# Altium schematic sheet Microcontroller.SchDoc
size A4; SheetNumber: 2; SheetTotal: 4
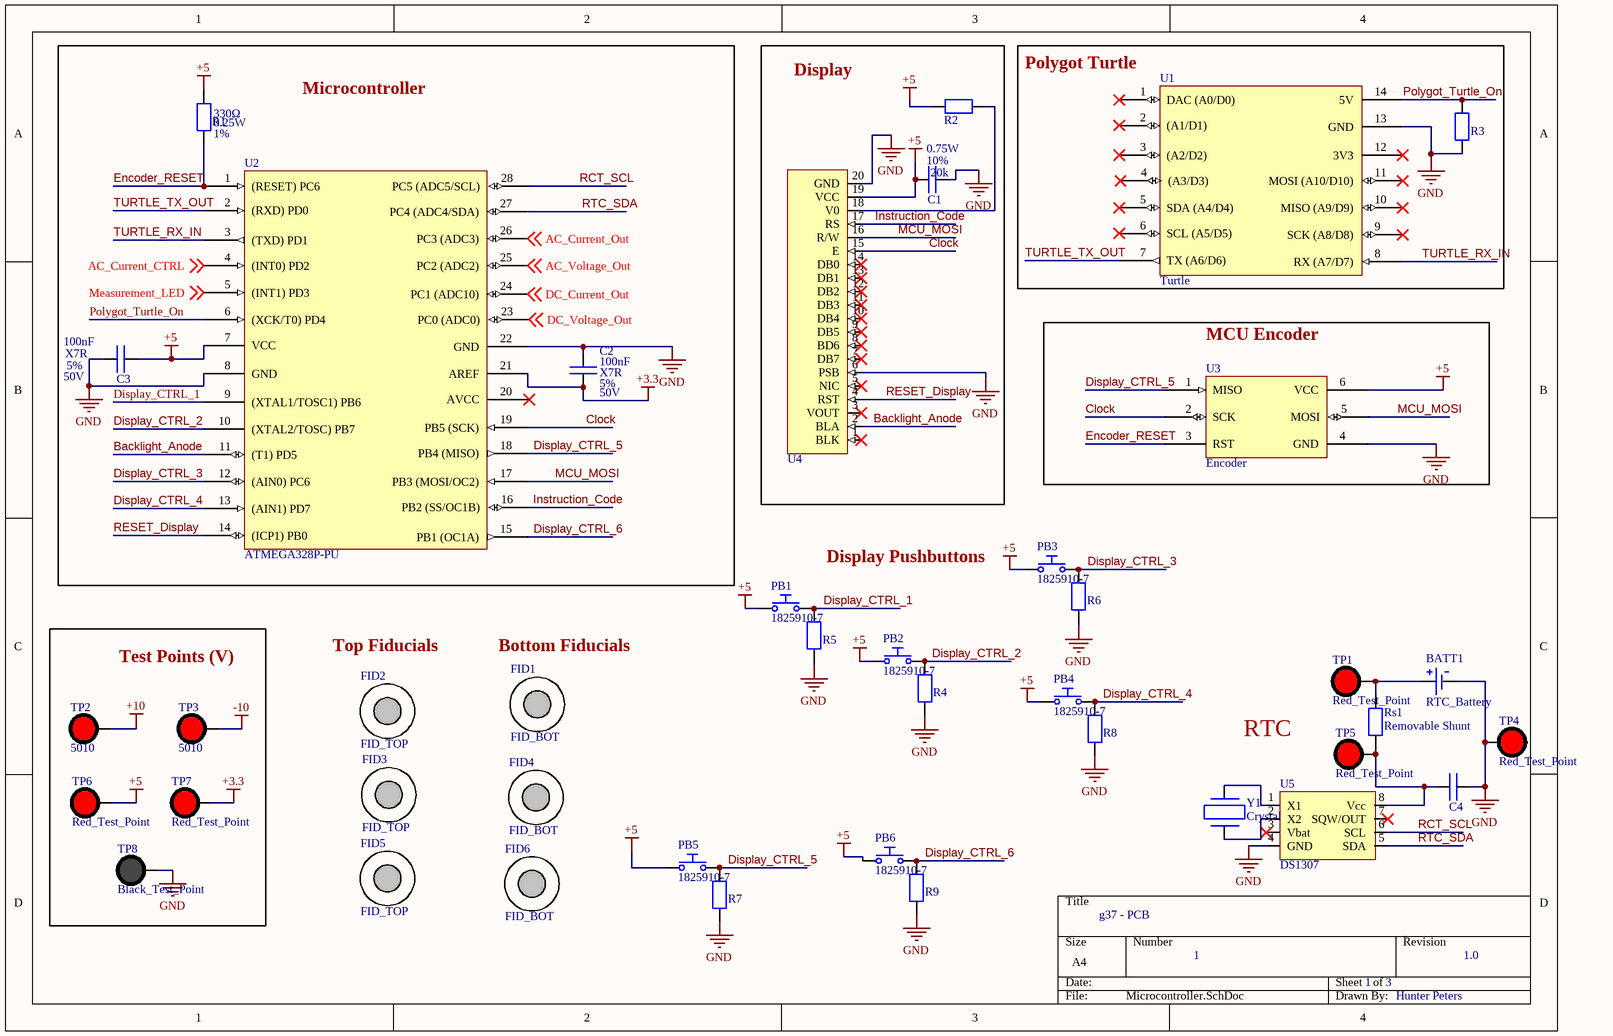
[diagram p0: Microcontroller.SchDoc]

## Parts
BATT1  RTC_Battery  [Battery Holder]
C1  Capacitor  [Capacitor]  (value not drawn)
C2  Capacitor  [Capacitor]  (value not drawn)
C3  Capacitor  [Capacitor]  (value not drawn)
C4  Capacitor  [Capacitor]  (value not drawn)
FID1  FID_BOT  [Fiducial_TOP]
FID2  FID_TOP  [Fiducial_TOP]
FID3  FID_TOP  [Fiducial_TOP]
FID4  FID_BOT  [Fiducial_TOP]
FID5  FID_TOP  [Fiducial_TOP]
FID6  FID_BOT  [Fiducial_TOP]
PB1  1825910-7  [Pushbutton]
PB2  1825910-7  [Pushbutton]
PB3  1825910-7  [Pushbutton]
PB4  1825910-7  [Pushbutton]
PB5  1825910-7  [Pushbutton]
PB6  1825910-7  [Pushbutton]
R1  Resistor  [Resistor]  (value not drawn)
R2  Resistor  [Resistor]  (value not drawn)
R3  Resistor  [Resistor]  (value not drawn)
R4  Resistor  [Resistor]  (value not drawn)
R5  Resistor  [Resistor]  (value not drawn)
R6  Resistor  [Resistor]  (value not drawn)
R7  Resistor  [Resistor]  (value not drawn)
R8  Resistor  [Resistor]  (value not drawn)
R9  Resistor  [Resistor]  (value not drawn)
Rs1  Removable Shunt  [Current_Shunt]
TP1  Red_Test_Point  [TP]
TP2  5010  [TP]
TP3  5010  [TP]
TP4  Red_Test_Point  [TP]
TP5  Red_Test_Point  [TP]
TP6  Red_Test_Point  [TP]
TP7  Red_Test_Point  [TP]
TP8  Black_Test_Point  [TP]
U1  Turtle  [Polygot-Turtle]
U2  ATMEGA328P-PU  [ATMEGA832P\]
U3  Encoder  [Encoder_No_Breakout]
U4  LED Display  [LED Display]  (value not drawn)
U5  DS1307  [Op Amp]
Y1  Crystal  [Crystal]

## Blocks framed on the sheet
Microcontroller: C2 C3 R1 U2
Display: C1 R2 U4
Polygot Turtle: R3 U1
MCU Encoder: U3
Test Points (V): TP2 TP3 TP6-TP8

## Nets
+3.3: C2.1 TP7.1 U2.21(AREF)
+5: C1.1 C3.1 PB1.1 PB2.1 PB3.1 PB4.1 PB5.1 PB6.1 R1.1 R2.1 TP6.1 U2.7(VCC) U3.6(VCC) U4.19(VCC)
+10: TP2.1
-10: TP3.1
GND: BATT1.2 C1.2 C2.2 C3.2 C4.2 R3.1 R4.1 R5.1 R6.1 R7.1 R8.1 R9.1 TP4.1 TP8.1 U1.13(GND) U2.8(GND) U2.22(GND) U3.4(GND) U4.6(PSB) U4.20(GND) U5.4(GND)
AC_Current_CTRL: U2.4((INT0)_PD2) ; off-sheet AC_Current_CTRL
AC_Current_Out: U2.26(PC3_(ADC3)) ; off-sheet AC_Current_Out
AC_Voltage_Out: U2.25(PC2_(ADC2)) ; off-sheet AC_Voltage_Out
Backlight_Anode: U2.11((T1)_PD5) U4.2(BLA)
Clock: U2.19(PB5_(SCK)) U3.2(SCK) U4.15(E)
DC_Current_Out: U2.24(PC1_(ADC10)) ; off-sheet DC_Current_Out
DC_Voltage_Out: U2.23(PC0_(ADC0)) ; off-sheet DC_Voltage_Out
Display_CTRL_1: PB1.2 R5.2 U2.9((XTAL1/TOSC1)_PB6)
Display_CTRL_2: PB2.2 R4.2 U2.10((XTAL2/TOSC)_PB7)
Display_CTRL_3: PB3.2 R6.2 U2.12((AIN0)_PC6)
Display_CTRL_4: PB4.2 R8.2 U2.13((AIN1)_PD7)
Display_CTRL_5: PB5.2 R7.2 U2.18(PB4_(MISO)) U3.1(MISO)
Display_CTRL_6: PB6.2 R9.2 U2.15(PB1_(OC1A))
Encoder_RESET: R1.2 U2.1((RESET)_PC6) U3.3(RST)
Instruction_Code: U2.16(PB2_(SS/OC1B)) U4.17(RS)
MCU_MOSI: U2.17(PB3_(MOSI/OC2)) U3.5(MOSI) U4.16(R/W)
Measurement_LED: U2.5((INT1)_PD3) ; off-sheet Measurement_LED
Polygot_Turtle_On: R3.2 U1.14(5V) U2.6((XCK/T0)_PD4)
RCT_SCL: U2.28(PC5_(ADC5/SCL)) U5.6(SCL)
RESET_Display: U2.14((ICP1)_PB0) U4.4(RST)
RTC_SDA: U2.27(PC4_(ADC4/SDA)) U5.5(SDA)
TURTLE_RX_IN: U1.8(RX_(A7/D7)) U2.3((TXD)_PD1)
TURTLE_TX_OUT: U1.7(TX_(A6/D6)) U2.2((RXD)_PD0)
NetBATT1_1: BATT1.1 Rs1.2 TP1.1
NetC4_1: C4.1 Rs1.1 TP5.1 U5.8(Vcc)
NetR2_2: R2.2 U4.18(V0)
NetU5_1: U5.1(X1) Y1.2
NetU5_2: U5.2(X2) Y1.1

Not connected (* = marked no-connect by the designer): U1 1(DAC_(A0/D0))* 2((A1/D1))* 3((A2/D2))* 4((A3/D3))* 5(SDA_(A4/D4))* 6(SCL_(A5/D5))* 9(SCK_(A8/D8))* 10(MISO_(A9/D9))* 11(MOSI_(A10/D10))* 12(3V3)*; U2 20(AVCC)*; U4 1(BLK)* 3(VOUT)* 5(NIC)* 7(DB7)* 8(BD6)* 9(DB5)* 10(DB4)* 11(DB3)* 12(DB2)* 13(DB1)* 14(DB0)*; U5 3(Vbat)* 7(SQW/OUT)*

## Notes on the sheet
- (near R1) 330Ω
- (near R1) 0.25W
- (near R1) 1%
- 0.75W
- (near C1) 10%
- (near C1) 20k
- (near C3) 100nF
- (near C3) 50V
- (near C3) X7R
- (near C3) 5%
- (near C2) 100nF
- (near C2) X7R
- (near C2) 5%
- (near C2) 50V
- Display Pushbuttons
- Top Fiducials
- (near FID1) Bottom Fiducials
- RTC
- g37 - PCB
- 1
- 3
- 1.0
- Hunter Peters

## Library data of the parts
FID1 FID4 FID6 = FID_Bottom
PB1-PB6 = 1825910-7: Keypad Switch, 1 Switches, SPST, Momentary, 0.05A, 24VDC, 2.548N, Solder Terminal, Panel Mount; Manufacturer: TE Connectivity; Manufacturer Lifecycle Status: ACTIVE; Actuator Length: 1.397mm; Actuator Material: PBT; Contact Current Rating: 50mA; Contact Resistance: 100mΩ; Electrical Life: 100kcycles; Illumination Type: Illuminated, Non-Illuminated; Max Voltage Rating (DC): 24V; Number of Positions: 1; Switch Function: Off-Mom; Switch Travel: 250µm; Supplier 1: DigiKey; Manufacturer Part Number: 1825910-7; RoHS: Compliant; Category: Pushbutton Switches; Stock 1: 35870; Pricing 1: 1=0.13, 10=0.118, 25=0.1112, 100=0.1001, 250=0.093, 750=0.08485, 1500=0.08009, 3000=0.07565, 5250=0.07234 (USD); China RoHS: Compliant; Color: Black, Red; Contact Material: Silver; Contact Plating: Silver; Current Rating: 50mA; Depth: 7.8mm; Export Control Classification Number (ECCN) Code: EAR99; ELV: Compliant; Height: 3.61mm; Housing Material: Nylon; Harmonized Tariff Schedule (HTS) Code: 8536.50.90.40; Introduction Date: 2008-01-30; Lead Free: Lead Free; Length: 5.99mm; Lifecycle Status: Production; Max Current Rating: 50mA; Max Operating Temperature: 85°C; Mechanical Life: 100kcycles; Min Operating Temperature: -35°C; Mount: Surface Mount, Through Hole; Operating Force: 2.548N; Orientation: Straight; Packaging: Bulk; Radiation Hardening: No; REACH SVHC: Yes; Schedule B: 8536509065, 8536509065|8536509065|8536509065|8536509065|8536509065|8536509065|8536509065|8536509065|8536509065|8536509065|8536509065|8536509065|8536509065|8536509065|8536509065|8536509065|8536509065|8536509065|8536509065|8536509065|8536509065|8536509065|8536509065|85; Termination: PC Pins, Solder; Throw Configuration: SPST; Type: Switch; Voltage Rating (DC): 24V; ComponentLink1URL: https://datasheet.octopart.com:443/1825910-7-TE-Connectivity-datasheet-179971976.pdf?src-supplier=IHS; ComponentLink1Description: https://datasheet.octopart.com:443/1825910-7-TE-Connectivity-datasheet-179971976.pdf?src-supplier=IHS; ComponentLink2URL: https://sigma.octopart.com:443/101748000/technical_drawing/TE-Connectivity-1825910-7.pdf?src-supplier=Sager+Electronics; ComponentLink2Description: https://sigma.octopart.com:443/101748000/technical_drawing/TE-Connectivity-1825910-7.pdf?src-supplier=Sager+Electronics; ComponentLink3URL: https://sigma.octopart.com:443/12291753/technical_drawing/TE-Connectivity-1825910-7.pdf?src-supplier=TE+Connectivity; ComponentLink3Description: https://sigma.octopart.com:443/12291753/technical_drawing/TE-Connectivity-1825910-7.pdf?src-supplier=TE+Connectivity; ComponentLink4URL: https://datasheet.octopart.com:443/1825910-7-TE-Connectivity-datasheet-10294628.pdf?src-supplier=Newark; ComponentLink4Description: https://datasheet.octopart.com:443/1825910-7-TE-Connectivity-datasheet-10294628.pdf?src-supplier=Newark; ComponentLink5URL: https://sigma.octopart.com:443/58177301/technical_drawing/TE-Connectivity-1825910-7.pdf?src-supplier=Farnell; ComponentLink5Description: https://sigma.octopart.com:443/58177301/technical_drawing/TE-Connectivity-1825910-7.pdf?src-supplier=Farnell; ComponentLink6URL: https://datasheet.octopart.com:443/1825910-7-TE-Connectivity---Alcoswitch-datasheet-33021037.pdf?src-supplier=Farnell; ComponentLink6Description: https://datasheet.octopart.com:443/1825910-7-TE-Connectivity---Alcoswitch-datasheet-33021037.pdf?src-supplier=Farnell; ComponentLink7URL: https://datasheet.octopart.com:443/1825910-7-TE-Connectivity---AMP-datasheet-23715109.pdf?src-supplier=Electro+Sonic; ComponentLink7Description: https://datasheet.octopart.com:443/1825910-7-TE-Connectivity---AMP-datasheet-23715109.pdf?src-supplier=Electro+Sonic; ComponentLink8URL: https://datasheet.octopart.com:443/1825910-7-TE-Connectivity-datasheet-145419879.pdf?src-supplier=RS+(Formerly+Allied+Electronics); ComponentLink8Description: https://datasheet.octopart.com:443/1825910-7-TE-Connectivity-datasheet-145419879.pdf?src-supplier=RS+(Formerly+Allied+Electronics); ComponentLink9URL: https://datasheet.octopart.com:443/1825910-7-TE-Connectivity---AMP-datasheet-189108451.pdf?src-supplier=Master+Electronics; ComponentLink9Description: https://datasheet.octopart.com:443/1825910-7-TE-Connectivity---AMP-datasheet-189108451.pdf?src-supplier=Master+Electronics; ComponentLink10URL: http://sigma.octopart.com:80/14574254/rohs_statement/TE-Connectivity-1825910-7.pdf?src-supplier=Compliance+Statements; ComponentLink10Description: http://sigma.octopart.com:80/14574254/rohs_statement/TE-Connectivity-1825910-7.pdf?src-supplier=Compliance+Statements; ComponentLink11URL: http://sigma.octopart.com:80/41598134/materials_sheet/TE-Connectivity-1825910-7.pdf?src-supplier=Compliance+Statements; ComponentLink11Description: http://sigma.octopart.com:80/41598134/materials_sheet/TE-Connectivity-1825910-7.pdf?src-supplier=Compliance+Statements; Supplier Part Number 1: 450-1804-ND
Rs1 = Current_Test_Shunt: Current_Shunt
TP2 TP3 = Red_Test_Point
U1 = 102010328: SAMD21 Microcontroller Development Board 0.0327MHz/48MHzCPU 32KB RAM 256KB Flash; Manufacturer: Seeed Studio; Supplier 1: DigiKey; Manufacturer Part Number: 102010328; Category: DSPs - Digital Signal Processors; Stock 1: 4270; Pricing 1: 1=5.4 (USD); Schedule B: 8471490000; Supplier Part Number 1: 1597-102010328-ND
U2 = ATMEGA328P-PU: Microchip - ATMEGA328P-PU - Microcontroller Mcu, 8 Bit, Atmega, 20MHZ, DIP-28; Manufacturer Lifecycle Status: REL; Core Architecture: AVR; Data Bus Width: 8b; Interface: 2-Wire, I2C, SPI, UART, USART; Max Supply Voltage: 5.5V; Memory Size: 32kB; Memory Type: FLASH; Min Supply Voltage: 1.8V; Number of ADC Channels: 6; Number of I2C Channels: 1; Number of I/Os: 23; Number of Timers/Counters: 3; Oscillator Type: Internal; Peripherals: Brown-out Detect/Reset, POR, PWM, WDT; RAM Size: 2kB; Watchdog Timer: Yes; Supplier 1: DigiKey; Manufacturer: Microchip; Manufacturer Part Number: ATMEGA328P-PU; RoHS: Compliant; Category: Microcontrollers; Stock 1: 49916; Pricing 1: 1=2.89, 25=2.65, 100=2.39 (USD); Projected EOL Date: 2039-11-04; Case/Package: PDIP; Contact Plating: Tin; Country of Assembly: Thailand; Country of Fabrication: United States of America; Country of Origin: Thailand; Export Control Classification Number (ECCN) Code: EAR99; Frequency: 20MHz; Height: 3.28mm; Harmonized Tariff Schedule (HTS) Code: 8542.31.0015; Lead Free: Lead Free; Length: 37.4mm; Lifecycle Status: Production; Max Frequency: 20MHz; Max Operating Temperature: 85°C; Min Operating Temperature: -40°C; Mount: Through Hole; Number of Pins: 28; Number of Programmable I/O: 23; Number of PWM Channels: 6; Number of SPI Channels: 1; Radiation Hardening: No; REACH SVHC: No; Schedule B: 8542310000, 8542310000|8542310000|8542310000|8542310000|8542310000; Width: 6.76mm; ComponentLink1URL: https://datasheet.octopart.com:443/ATMEGA328P-PU-Microchip-datasheet-147334532.pdf?src-supplier=Microchip; ComponentLink1Description: https://datasheet.octopart.com:443/ATMEGA328P-PU-Microchip-datasheet-147334532.pdf?src-supplier=Microchip; ComponentLink2URL: https://datasheet.octopart.com:443/ATMEGA328P-PU-Microchip-datasheet-148646239.pdf?src-supplier=Microchip; ComponentLink2Description: https://datasheet.octopart.com:443/ATMEGA328P-PU-Microchip-datasheet-148646239.pdf?src-supplier=Microchip; ComponentLink3URL: https://datasheet.octopart.com:443/ATMEGA328P-PU-Microchip-datasheet-68295846.pdf?src-supplier=SHENGYU+ELECTRONICS; ComponentLink3Description: https://datasheet.octopart.com:443/ATMEGA328P-PU-Microchip-datasheet-68295846.pdf?src-supplier=SHENGYU+ELECTRONICS; ComponentLink4URL: https://datasheet.octopart.com:443/ATMEGA328P-PU-Microchip-datasheet-14421303.pdf?src-supplier=Upverter; ComponentLink4Description: https://datasheet.octopart.com:443/ATMEGA328P-PU-Microchip-datasheet-14421303.pdf?src-supplier=Upverter; ComponentLink5URL: https://datasheet.octopart.com:443/ATMEGA328P-PU-Atmel-datasheet-34147914.pdf?src-supplier=Upverter; ComponentLink5Description: https://datasheet.octopart.com:443/ATMEGA328P-PU-Atmel-datasheet-34147914.pdf?src-supplier=Upverter; ComponentLink6URL: https://datasheet.octopart.com:443/ATMEGA328P-PU-Atmel-datasheet-14353408.pdf?src-supplier=Upverter; ComponentLink6Description: https://datasheet.octopart.com:443/ATMEGA328P-PU-Atmel-datasheet-14353408.pdf?src-supplier=Upverter; ComponentLink7URL: https://datasheet.octopart.com:443/ATMEGA328P-PU-Microchip-datasheet-133520744.pdf?src-supplier=LKR; ComponentLink7Description: https://datasheet.octopart.com:443/ATMEGA328P-PU-Microchip-datasheet-133520744.pdf?src-supplier=LKR; ComponentLink8URL: https://datasheet.octopart.com:443/ATMEGA328P-PU-Microchip-datasheet-62316222.pdf?src-supplier=element14+APAC; ComponentLink8Description: https://datasheet.octopart.com:443/ATMEGA328P-PU-Microchip-datasheet-62316222.pdf?src-supplier=element14+APAC; ComponentLink9URL: https://datasheet.octopart.com:443/ATMEGA328P-PU-Atmel-datasheet-13381135.pdf?src-supplier=element14+APAC; ComponentLink9Description: https://datasheet.octopart.com:443/ATMEGA328P-PU-Atmel-datasheet-13381135.pdf?src-supplier=element14+APAC; ComponentLink10URL: https://datasheet.octopart.com:443/ATMEGA328P-PU-Microchip-datasheet-154741723.pdf?src-supplier=Electro+Sonic; ComponentLink10Description: https://datasheet.octopart.com:443/ATMEGA328P-PU-Microchip-datasheet-154741723.pdf?src-supplier=Electro+Sonic; ComponentLink11URL: https://datasheet.octopart.com:443/ATMEGA328P-PU-Microchip-datasheet-100453898.pdf?src-supplier=Burklin+Elektronik; ComponentLink11Description: https://datasheet.octopart.com:443/ATMEGA328P-PU-Microchip-datasheet-100453898.pdf?src-supplier=Burklin+Elektronik; ComponentLink12URL: https://datasheet.octopart.com:443/ATMEGA328P-PU-Atmel-datasheet-30457899.pdf?src-supplier=Seeed+Studio; ComponentLink12Description: https://datasheet.octopart.com:443/ATMEGA328P-PU-Atmel-datasheet-30457899.pdf?src-supplier=Seeed+Studio; ComponentLink13URL: https://datasheet.octopart.com:443/ATMEGA328P-PU-Microchip-datasheet-10842036.pdf?src-supplier=SOS+electronic; ComponentLink13Description: https://datasheet.octopart.com:443/ATMEGA328P-PU-Microchip-datasheet-10842036.pdf?src-supplier=SOS+electronic; ComponentLink14URL: https://datasheet.octopart.com:443/ATMEGA328P-PU-Microchip-datasheet-8364063.pdf?src-supplier=Jameco; ComponentLink14Description: https://datasheet.octopart.com:443/ATMEGA328P-PU-Microchip-datasheet-8364063.pdf?src-supplier=Jameco; ComponentLink15URL: https://datasheet.octopart.com:443/ATMEGA328P-PU-Microchip-datasheet-154323124.pdf?src-supplier=Jameco; ComponentLink15Description: https://datasheet.octopart.com:443/ATMEGA328P-PU-Microchip-datasheet-154323124.pdf?src-supplier=Jameco; ComponentLink16URL: https://datasheet.octopart.com:443/ATMEGA328P-PU-Atmel-datasheet-10389530.pdf?src-supplier=Newark; ComponentLink16Description: https://datasheet.octopart.com:443/ATMEGA328P-PU-Atmel-datasheet-10389530.pdf?src-supplier=Newark; ComponentLink17URL: https://datasheet.octopart.com:443/ATMEGA328P-PU-Microchip-datasheet-65729177.pdf?src-supplier=TME; ComponentLink17Description: https://datasheet.octopart.com:443/ATMEGA328P-PU-Microchip-datasheet-65729177.pdf?src-supplier=TME; ComponentLink18URL: https://datasheet.octopart.com:443/ATMEGA328P-PU-Microchip-datasheet-101746195.pdf?src-supplier=Future+Electronics; ComponentLink18Description: https://datasheet.octopart.com:443/ATMEGA328P-PU-Microchip-datasheet-101746195.pdf?src-supplier=Future+Electronics; ComponentLink19URL: http://sigma.octopart.com:80/188450569/materials_sheet/Microchip-ATMEGA328P-PU.pdf?src-supplier=Compliance+Statements; ComponentLink19Description: http://sigma.octopart.com:80/188450569/materials_sheet/Microchip-ATMEGA328P-PU.pdf?src-supplier=Compliance+Statements; ComponentLink20URL: http://sigma.octopart.com:80/rohs_statement/Microchip-company-71.pdf?src-supplier=Compliance+Statements; ComponentLink20Description: http://sigma.octopart.com:80/rohs_statement/Microchip-company-71.pdf?src-supplier=Compliance+Statements; ComponentLink21URL: http://sigma.octopart.com:80/reach_statement/Microchip-company-70.pdf?src-supplier=Compliance+Statements; ComponentLink21Description: http://sigma.octopart.com:80/reach_statement/Microchip-company-70.pdf?src-supplier=Compliance+Statements; ComponentLink22URL: http://sigma.octopart.com:80/conflict_mineral_statement/Microchip-company-69.pdf?src-supplier=Compliance+Statements; ComponentLink22Description: http://sigma.octopart.com:80/conflict_mineral_statement/Microchip-company-69.pdf?src-supplier=Compliance+Statements; ComponentLink23URL: http://sigma.octopart.com:80/conflict_mineral_statement/Microchip-company-68.pdf?src-supplier=Compliance+Statements; ComponentLink23Description: http://sigma.octopart.com:80/conflict_mineral_statement/Microchip-company-68.pdf?src-supplier=Compliance+Statements; ComponentLink24URL: http://sigma.octopart.com:80/reach_statement/Atmel-company-6.pdf?src-supplier=Compliance+Statements; ComponentLink24Description: http://sigma.octopart.com:80/reach_statement/Atmel-company-6.pdf?src-supplier=Compliance+Statements; ComponentLink25URL: http://sigma.octopart.com:80/rohs_statement/Atmel-company-5.pdf?src-supplier=Compliance+Statements; ComponentLink25Description: http://sigma.octopart.com:80/rohs_statement/Atmel-company-5.pdf?src-supplier=Compliance+Statements; ComponentLink26URL: http://sigma.octopart.com:80/rohs_statement/Atmel-company-4.pdf?src-supplier=Compliance+Statements; ComponentLink26Description: http://sigma.octopart.com:80/rohs_statement/Atmel-company-4.pdf?src-supplier=Compliance+Statements; Supplier Part Number 1: ATMEGA328P-PU-ND
U3 = 1465: Adafruit 6-Pin Avr Isp Breadboard Adapter Mini Kit |Adafruit 1465; Manufacturer: Adafruit Industries; Supplier 1: DigiKey; Manufacturer Part Number: 1465; RoHS: Compliant; Category: Uncategorized; Stock 1: 113; Pricing 1: 1=0.95 (USD); Schedule B: 8542900000, 8542900000|8542900000|8542900000|8542900000|8542900000; Supplier Part Number 1: 1528-1189-ND
U4 = Display
U5 = RTC